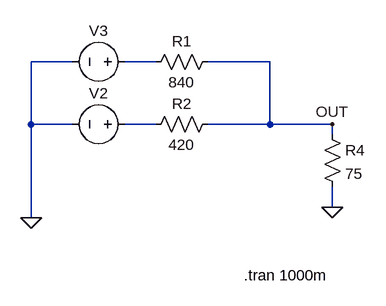
[diagram p0: schematic 2bitdac.asc]
2bitdac.asc, the LTspice schematic file:
Version 4.1
SHEET 1 880 680
WIRE -480 -96 -544 -96
WIRE -352 -96 -400 -96
WIRE -176 -96 -272 -96
WIRE -544 0 -544 -96
WIRE -480 0 -544 0
WIRE -352 0 -400 0
WIRE -176 0 -176 -96
WIRE -176 0 -272 0
WIRE -80 0 -176 0
WIRE -80 16 -80 0
WIRE -80 128 -80 96
WIRE -544 144 -544 0
FLAG -80 128 0
FLAG -80 0 OUT
FLAG -544 144 0
SYMBOL res -368 -80 R270
WINDOW 0 32 56 VTop 2
WINDOW 3 0 56 VBottom 2
SYMATTR InstName R1
SYMATTR Value 840
SYMBOL res -368 16 R270
WINDOW 0 32 56 VTop 2
WINDOW 3 0 56 VBottom 2
SYMATTR InstName R2
SYMATTR Value 420
SYMBOL res -96 0 R0
SYMATTR InstName R4
SYMATTR Value 75
SYMBOL voltage -384 0 M270
WINDOW 0 32 56 VTop 2
WINDOW 3 -32 56 Invisible 2
WINDOW 123 0 0 Left 0
WINDOW 39 0 0 Left 0
SYMATTR InstName V2
SYMATTR Value PULSE(0 3.3 20m 0 0 20m 40m 2)
SYMBOL voltage -384 -96 M270
WINDOW 0 32 56 VTop 2
WINDOW 3 -32 56 Invisible 2
WINDOW 123 0 0 Left 0
WINDOW 39 0 0 Left 0
SYMATTR InstName V3
SYMATTR Value PULSE(0 3.3 10m 0 0 10m 20m 4)
TEXT -216 232 Left 2 !.tran 1000m

The netlist it stands for:
* 2bitdac.asc
R1 N001 OUT 840
R2 N002 OUT 420
R4 OUT 0 75
V2 N002 0 PULSE(0 3.3 20m 0 0 20m 40m 2)
V3 N001 0 PULSE(0 3.3 10m 0 0 10m 20m 4)
.tran 1000m
.backanno
.end